# Altium schematic sheet Sheet1.SchDoc
size A4; DocumentNumber: 1; SheetNumber: 1; SheetTotal: 2
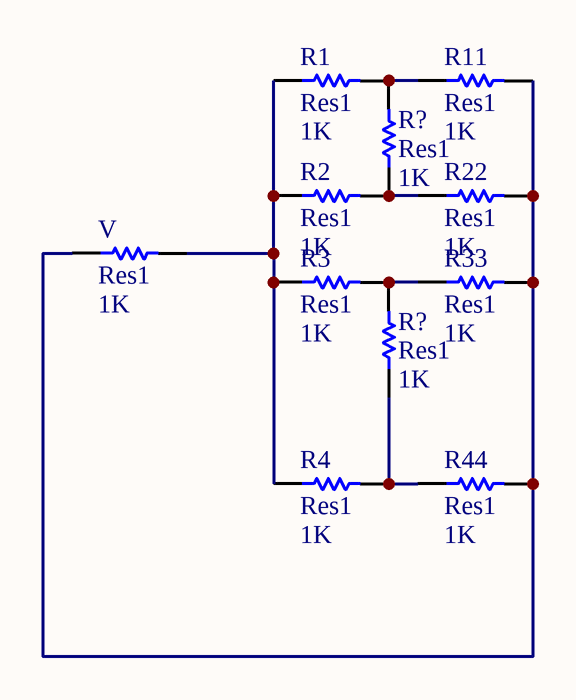
[diagram p0: Sheet1.SchDoc]

## Parts
(Parts that share a designator on the sheet are numbered #1, #2 ... from top to bottom, then left to right.)
R1  Res1  value 1K  [AXIAL-0.3]
R2  Res1  value 1K  [AXIAL-0.3]
R3  Res1  value 1K  [AXIAL-0.3]
R4  Res1  value 1K  [AXIAL-0.3]
R11  Res1  value 1K  [AXIAL-0.3]
R22  Res1  value 1K  [AXIAL-0.3]
R33  Res1  value 1K  [AXIAL-0.3]
R44  Res1  value 1K  [AXIAL-0.3]
R?#1  Res1  value 1K  [AXIAL-0.3]
R?#2  Res1  value 1K  [AXIAL-0.3]
V  Res1  value 1K  [AXIAL-0.3]

## Nets
NetR1_1: R1.1 R2.1 R3.1 R4.1 V.2
NetR1_2: R1.2 R11.1 R?#1.2
NetR2_2: R2.2 R22.1 R?#1.1
NetR3_2: R3.2 R33.1 R?#2.2
NetR4_2: R4.2 R44.1 R?#2.1
NetR11_2: R11.2 R22.2 R33.2 R44.2 V.1

## Library data of the parts
R1-R4 R11 R22 R33 R44 R?#1 R?#2 V = Res1: Resistor; Published: 8-Jun-2000; LatestRevisionDate: 17-Jul-2002; LatestRevisionNote: Re-released for DXP Platform.; PackageReference: AXIAL-0.3; Publisher: Altium Limited; PackageDescription: Axial Device, Thru-Hole; 2 Leads; 0.3 in Pin Spacing